# Altium schematic sheet Public_QSGMII_ETHERNET_TRANSCEIVER_1.SchDoc
size D
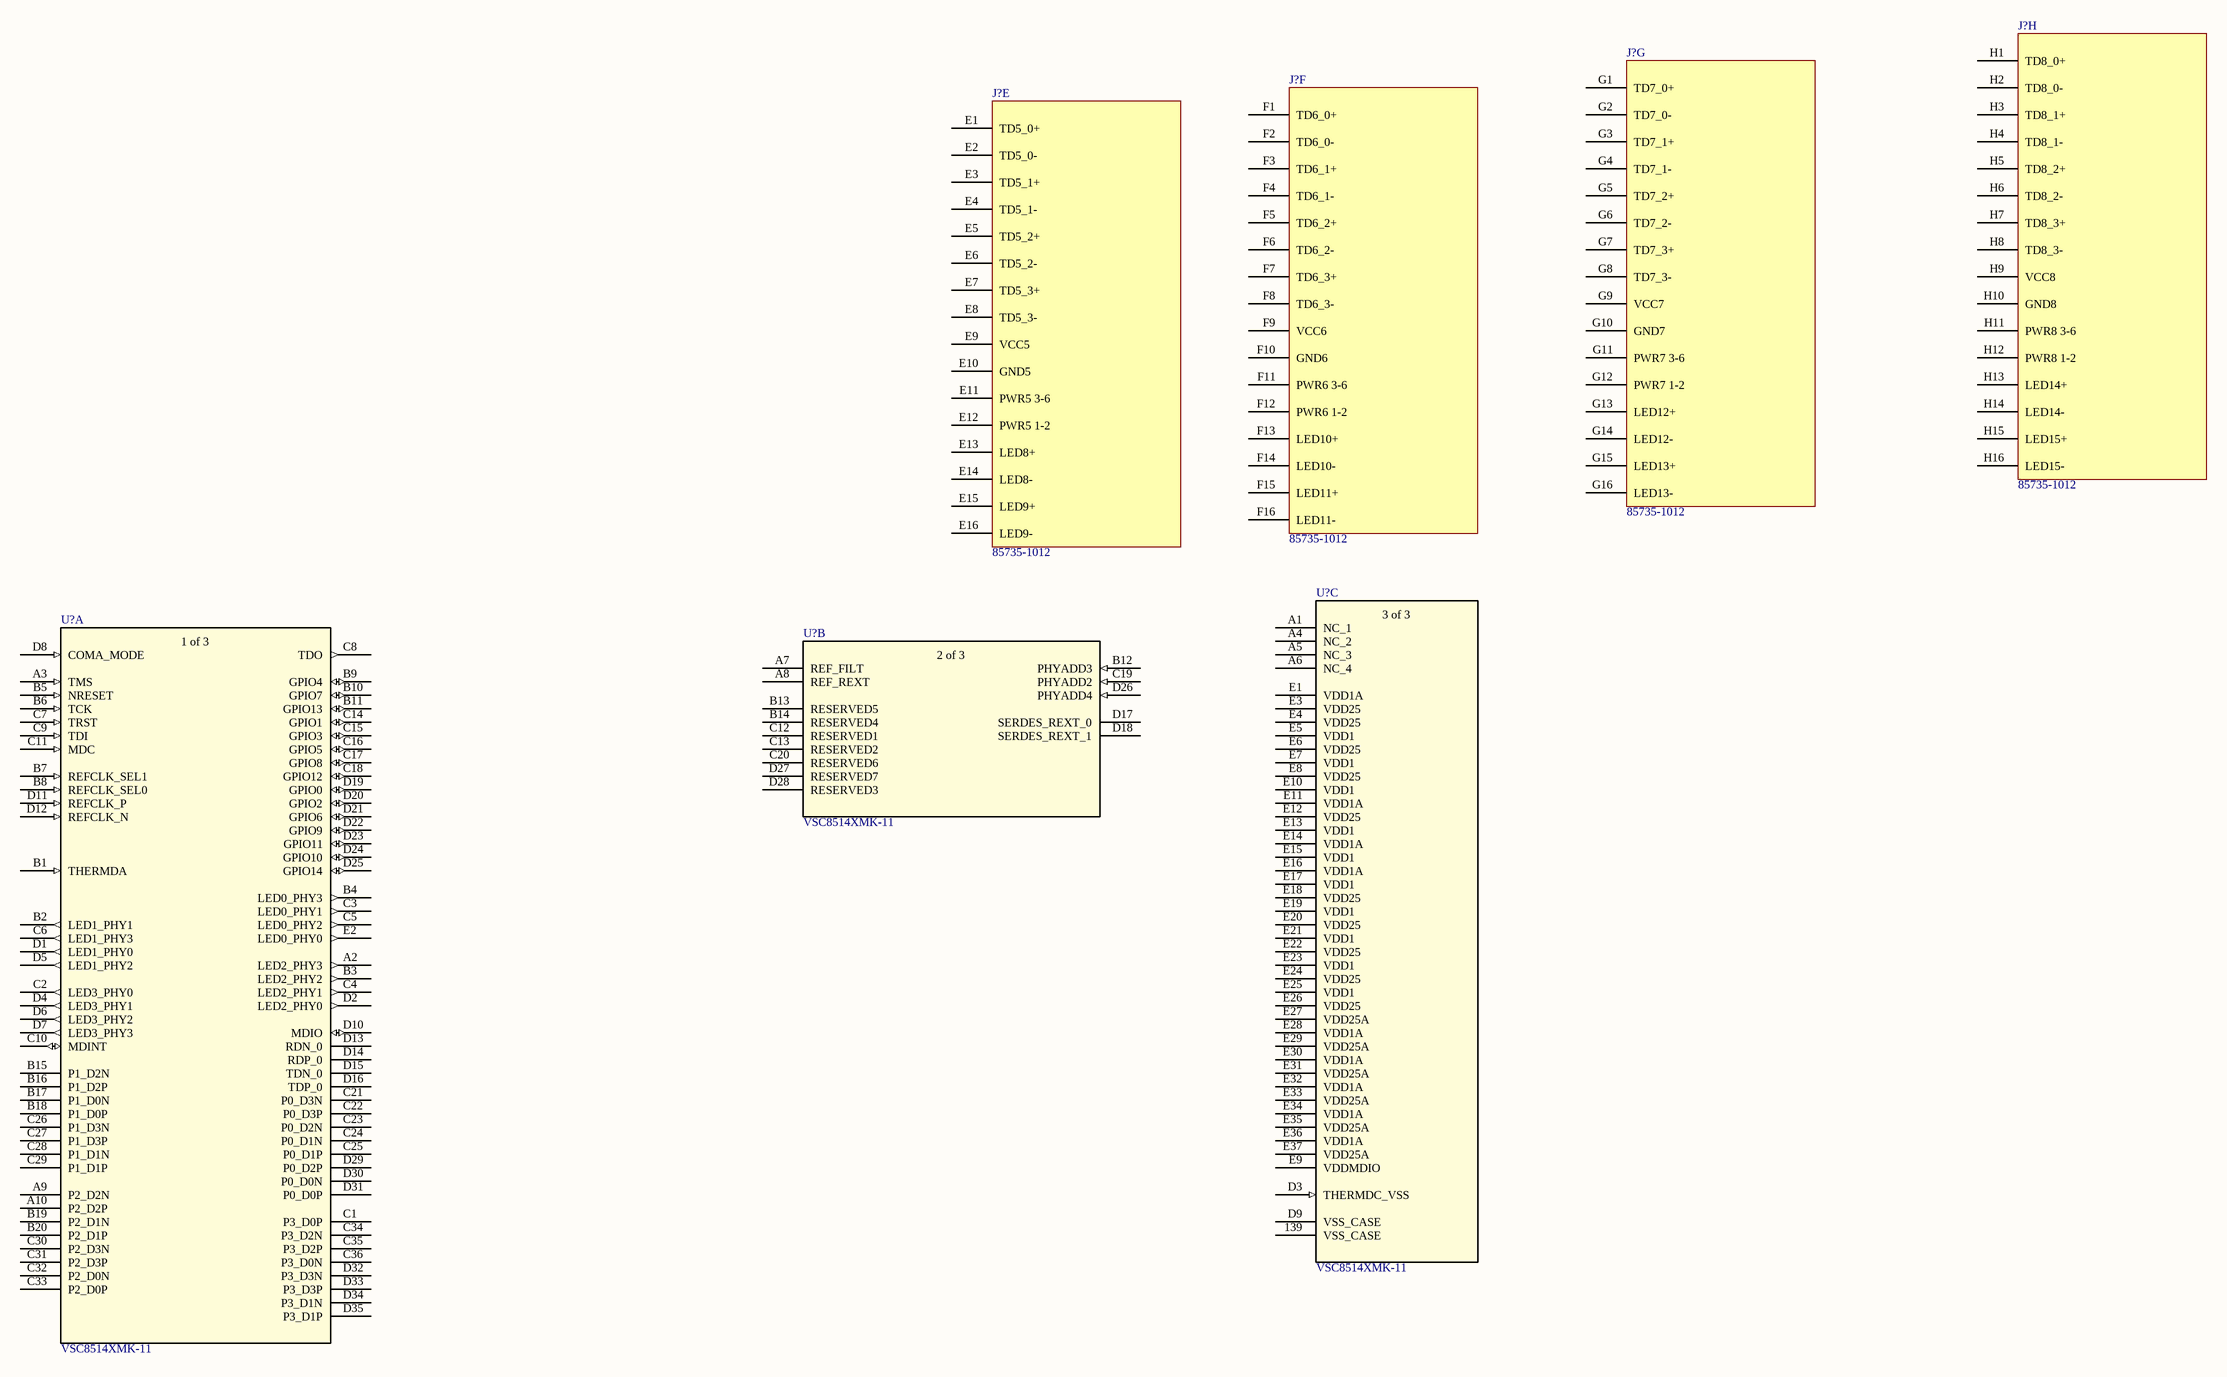
[diagram p0: Public_QSGMII_ETHERNET_TRANSCEIVER_1.SchDoc]

## Parts
(Parts that share a designator on the sheet are numbered #1, #2 ... from top to bottom, then left to right.)
J?#1  85735-1012  [857351012]  (part H of 8)
J?#2  85735-1012  [857351012]  (part G of 8)
J?#3  85735-1012  [857351012]  (part F of 8)
J?#4  85735-1012  [857351012]  (part E of 8)
U?#1  VSC8514XMK-11  [QFN138_12X12X0P85_MCH]  (part C of 3)
U?#2  VSC8514XMK-11  [QFN138_12X12X0P85_MCH]  (part A of 3)
U?#3  VSC8514XMK-11  [QFN138_12X12X0P85_MCH]  (part B of 3)

## Nets

Not connected (* = marked no-connect by the designer): J?#1 H1(TD8_0+) H2(TD8_0-) H3(TD8_1+) H4(TD8_1-) H5(TD8_2+) H6(TD8_2-) H7(TD8_3+) H8(TD8_3-) H9(VCC8) H10(GND8) H11(PWR8_3-6) H12(PWR8_1-2) H13(LED14+) H14(LED14-) H15(LED15+) H16(LED15-); J?#2 G1(TD7_0+) G2(TD7_0-) G3(TD7_1+) G4(TD7_1-) G5(TD7_2+) G6(TD7_2-) G7(TD7_3+) G8(TD7_3-) G9(VCC7) G10(GND7) G11(PWR7_3-6) G12(PWR7_1-2) G13(LED12+) G14(LED12-) G15(LED13+) G16(LED13-); J?#3 F1(TD6_0+) F2(TD6_0-) F3(TD6_1+) F4(TD6_1-) F5(TD6_2+) F6(TD6_2-) F7(TD6_3+) F8(TD6_3-) F9(VCC6) F10(GND6) F11(PWR6_3-6) F12(PWR6_1-2) F13(LED10+) F14(LED10-) F15(LED11+) F16(LED11-); J?#4 E1(TD5_0+) E2(TD5_0-) E3(TD5_1+) E4(TD5_1-) E5(TD5_2+) E6(TD5_2-) E7(TD5_3+) E8(TD5_3-) E9(VCC5) E10(GND5) E11(PWR5_3-6) E12(PWR5_1-2) E13(LED8+) E14(LED8-) E15(LED9+) E16(LED9-); U?#1 139(VSS_CASE) A1(NC_1) A4(NC_2) A5(NC_3) A6(NC_4) D3(THERMDC_VSS) D9(VSS_CASE) E1(VDD1A) E3(VDD25) E4(VDD25) E5(VDD1) E6(VDD25) E7(VDD1) E8(VDD25) E9(VDDMDIO) E10(VDD1) E11(VDD1A) E12(VDD25) E13(VDD1) E14(VDD1A) E15(VDD1) E16(VDD1A) E17(VDD1) E18(VDD25) E19(VDD1) E20(VDD25) E21(VDD1) E22(VDD25) E23(VDD1) E24(VDD25) E25(VDD1) E26(VDD25) E27(VDD25A) E28(VDD1A) E29(VDD25A) E30(VDD1A) E31(VDD25A) E32(VDD1A) E33(VDD25A) E34(VDD1A) E35(VDD25A) E36(VDD1A) E37(VDD25A); U?#2 A2(LED2_PHY3) A3(TMS) A9(P2_D2N) A10(P2_D2P) B1(THERMDA) B2(LED1_PHY1) B3(LED2_PHY2) B4(LED0_PHY3) B5(NRESET) B6(TCK) B7(REFCLK_SEL1) B8(REFCLK_SEL0) B9(GPIO4) B10(GPIO7) B11(GPIO13) B15(P1_D2N) B16(P1_D2P) B17(P1_D0N) B18(P1_D0P) B19(P2_D1N) B20(P2_D1P) C1(P3_D0P) C2(LED3_PHY0) C3(LED0_PHY1) C4(LED2_PHY1) C5(LED0_PHY2) C6(LED1_PHY3) C7(TRST) C8(TDO) C9(TDI) C10(MDINT) C11(MDC) C14(GPIO1) C15(GPIO3) C16(GPIO5) C17(GPIO8) C18(GPIO12) C21(P0_D3N) C22(P0_D3P) C23(P0_D2N) C24(P0_D1N) C25(P0_D1P) C26(P1_D3N) C27(P1_D3P) C28(P1_D1N) C29(P1_D1P) C30(P2_D3N) C31(P2_D3P) C32(P2_D0N) C33(P2_D0P) C34(P3_D2N) C35(P3_D2P) C36(P3_D0N) D1(LED1_PHY0) D2(LED2_PHY0) D4(LED3_PHY1) D5(LED1_PHY2) D6(LED3_PHY2) D7(LED3_PHY3) D8(COMA_MODE) D10(MDIO) D11(REFCLK_P) D12(REFCLK_N) D13(RDN_0) D14(RDP_0) D15(TDN_0) D16(TDP_0) D19(GPIO0) D20(GPIO2) D21(GPIO6) D22(GPIO9) D23(GPIO11) D24(GPIO10) D25(GPIO14) D29(P0_D2P) D30(P0_D0N) D31(P0_D0P) D32(P3_D3N) D33(P3_D3P) D34(P3_D1N) D35(P3_D1P) E2(LED0_PHY0); U?#3 A7(REF_FILT) A8(REF_REXT) B12(PHYADD3) B13(RESERVED5) B14(RESERVED4) C12(RESERVED1) C13(RESERVED2) C19(PHYADD2) C20(RESERVED6) D17(SERDES_REXT_0) D18(SERDES_REXT_1) D26(PHYADD4) D27(RESERVED7) D28(RESERVED3)

## Notes on the sheet
- Title
- Size:
- Date:
- File:
- D
- Number:
- Time:
- Revision:
- Sheet
- of
- (in symbol VSC8514XMK-11, part A) 1 of 3
- (in symbol VSC8514XMK-11, part B) 2 of 3
- (in symbol VSC8514XMK-11, part C) 3 of 3

## Library data of the parts
J?#1-J?#4 = 85735-1012: Connector; Manufacturer_Name: Molex; Datasheet Link: https://www.molex.com/pdm_docs/sd/857351012_sd.pdf; Height: 25.71mm; Manufacturer_Part_Number: 85735-1012; Mouser Part Number: N/A; Mouser Price/Stock: https://www.mouser.co.uk/ProductDetail/Molex/85735-1012?qs=yd8XiKYcH9lIdOAreapLrg%3D%3D
U?#1-U?#3 = VSC8514XMK-11: No Description Available; SourceLibrary: Microchip_2020-10-14; Built_By: EMA_Cory; Vendor: Microchip; Datasheet: https://ww1.microchip.com/downloads/en/DeviceDoc/VMDS-10446.pdf; Copyright: Copyright (C) 2018 Accelerated Designs. All rights reserved; Manufacturer_Part_Number: VSC8514XMK-11; RefDes: RefDes; Type: DEV